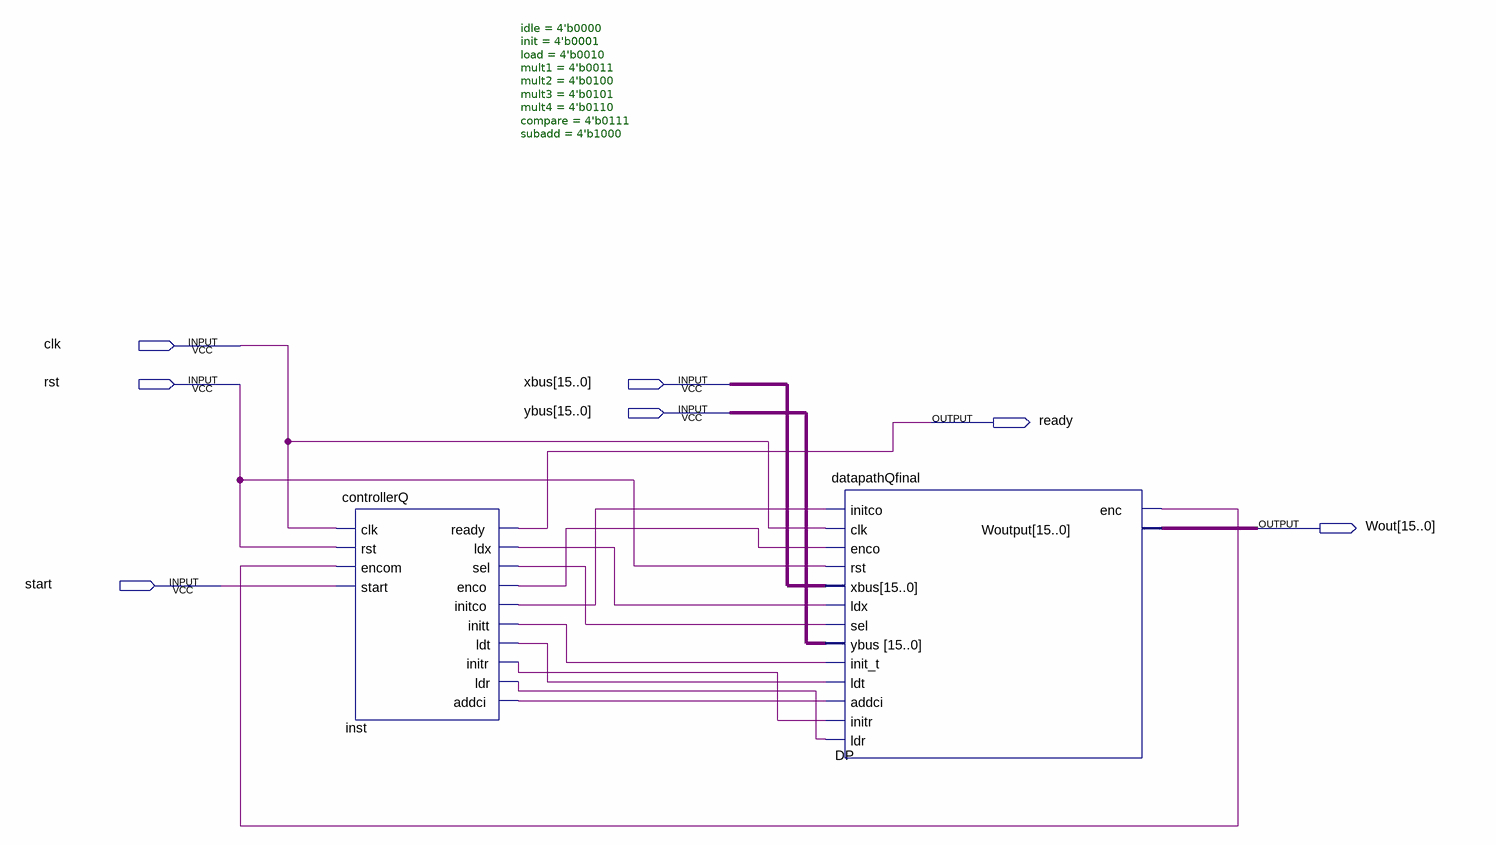
[diagram p0: schematic sheet]
// Quartus schematic finalDP.bdf as structural Verilog: 2 symbols, 7 pins
module finalDP (
  input  clk,
  input  rst,
  input  [15:0] xbus,
  input  [15:0] ybus,
  input  start,
  output ready,
  output [15:0] Wout
);

  wire DP_enc, inst_addci, inst_enco, inst_initco, inst_initr, inst_initt, inst_ldr, inst_ldt, inst_ldx,
       inst_sel;

  controllerQ #(.idle(4'b0000), .init(4'b0001), .load(4'b0010), .mult1(4'b0011), .mult2(4'b0100), .mult3(4'b0101), .mult4(4'b0110), .compare(4'b0111), .subadd(4'b1000)) inst (
    .clk(clk), .rst(rst), .encom(DP_enc), .start(start), .ready(ready), .ldx(inst_ldx), .sel(inst_sel),
    .enco(inst_enco), .initco(inst_initco), .initt(inst_initt), .ldt(inst_ldt), .initr(inst_initr),
    .ldr(inst_ldr), .addci(inst_addci));
  datapathQfinal DP (
    .initco(inst_initco), .clk(clk), .enco(inst_enco), .rst(rst), .xbus(xbus), .ldx(inst_ldx),
    .sel(inst_sel), .ybus(ybus), .init_t(inst_initt), .ldt(inst_ldt), .addci(inst_addci), .initr(inst_initr),
    .ldr(inst_ldr), .enc(DP_enc), .Woutput(Wout));
endmodule
